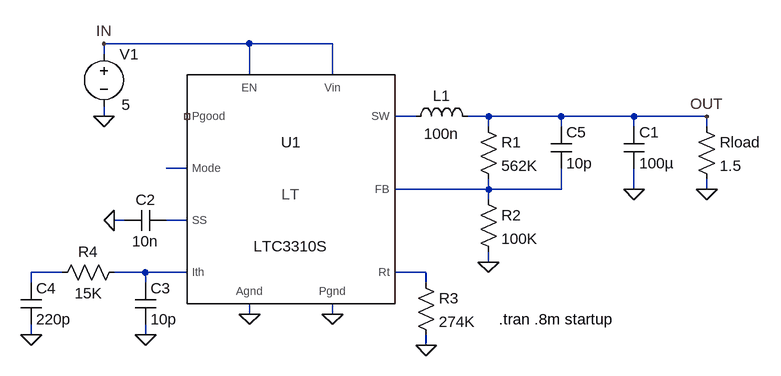
[diagram p0: schematic 3310S.asc]
3310S.asc, the LTspice schematic file:
Version 4
SHEET 1 2648 1864
WIRE 1648 1248 1424 1248
WIRE 1776 1248 1648 1248
WIRE 1424 1264 1424 1248
WIRE 1648 1296 1648 1248
WIRE 1776 1296 1776 1248
WIRE 1424 1360 1424 1344
WIRE 1904 1360 1872 1360
WIRE 2016 1360 1984 1360
WIRE 2128 1360 2016 1360
WIRE 2240 1360 2128 1360
WIRE 2352 1360 2240 1360
WIRE 2016 1376 2016 1360
WIRE 2128 1376 2128 1360
WIRE 2240 1376 2240 1360
WIRE 2352 1376 2352 1360
WIRE 1552 1440 1520 1440
WIRE 2016 1472 2016 1456
WIRE 2016 1472 1872 1472
WIRE 2128 1472 2128 1440
WIRE 2128 1472 2016 1472
WIRE 2240 1472 2240 1440
WIRE 2352 1472 2352 1456
WIRE 2016 1488 2016 1472
WIRE 1456 1520 1440 1520
WIRE 1552 1520 1520 1520
WIRE 2016 1584 2016 1568
WIRE 1360 1600 1312 1600
WIRE 1488 1600 1440 1600
WIRE 1552 1600 1488 1600
WIRE 1920 1600 1872 1600
WIRE 1312 1616 1312 1600
WIRE 1488 1616 1488 1600
WIRE 1920 1616 1920 1600
WIRE 1648 1664 1648 1648
WIRE 1776 1664 1776 1648
WIRE 1312 1696 1312 1680
WIRE 1488 1696 1488 1680
WIRE 1920 1712 1920 1696
FLAG 1776 1664 0
FLAG 1648 1664 0
FLAG 1424 1360 0
FLAG 2352 1472 0
FLAG 2016 1584 0
FLAG 1440 1520 0
FLAG 2352 1360 OUT
FLAG 1424 1248 IN
FLAG 1312 1696 0
FLAG 1488 1696 0
FLAG 1920 1712 0
FLAG 2240 1472 0
SYMBOL ind 1888 1376 R270
WINDOW 0 32 56 VTop 2
WINDOW 3 5 56 VBottom 2
SYMATTR InstName L1
SYMATTR Value 100n
SYMATTR SpiceLine Rser=2m
SYMBOL RES 2000 1360 R0
SYMATTR InstName R1
SYMATTR Value 562K
SYMBOL VOLTAGE 1424 1248 R0
WINDOW 3 27 94 Left 2
SYMATTR Value 5
SYMATTR InstName V1
SYMBOL res 2000 1472 R0
SYMATTR InstName R2
SYMATTR Value 100K
SYMBOL cap 2112 1376 R0
SYMATTR InstName C5
SYMATTR Value 10p
SYMBOL res 2336 1360 R0
SYMATTR InstName Rload
SYMATTR Value 1.5
SYMBOL cap 1520 1504 R90
WINDOW 0 0 32 VBottom 2
WINDOW 3 32 32 VTop 2
SYMATTR InstName C2
SYMATTR Value 10n
SYMBOL LTC3310S 1712 1456 R0
SYMATTR InstName U1
SYMBOL cap 1296 1616 R0
SYMATTR InstName C4
SYMATTR Value 220p
SYMBOL res 1904 1600 R0
SYMATTR InstName R3
SYMATTR Value 274K
SYMBOL cap 1472 1616 R0
SYMATTR InstName C3
SYMATTR Value 10p
SYMBOL res 1456 1584 R90
WINDOW 0 0 56 VBottom 2
WINDOW 3 32 56 VTop 2
SYMATTR InstName R4
SYMATTR Value 15K
SYMBOL cap 2224 1376 R0
SYMATTR InstName C1
SYMATTR Value 100µ
TEXT 2032 1672 Left 2 !.tran .8m startup

The netlist it stands for:
* 3310S.asc
L1 N001 OUT 100n Rser=2m
R1 OUT N003 562K
V1 IN 0 5
R2 N003 0 100K
C5 OUT N003 10p
Rload OUT 0 1.5
C2 N004 0 10n
XU1 IN IN N001 N003 0 0 N007 NC_01 N002 N006 N004 LTC3310S  ; pins Vin EN SW FB Agnd Pgnd Rt Pgood Mode Ith SS
C4 N005 0 220p
R3 N007 0 274K
C3 N006 0 10p
R4 N006 N005 15K
C1 OUT 0 100µ
.tran .8m startup
.lib LTC3310S.sub
.backanno
.end